# Altium project CNC_controller.PrjPcb
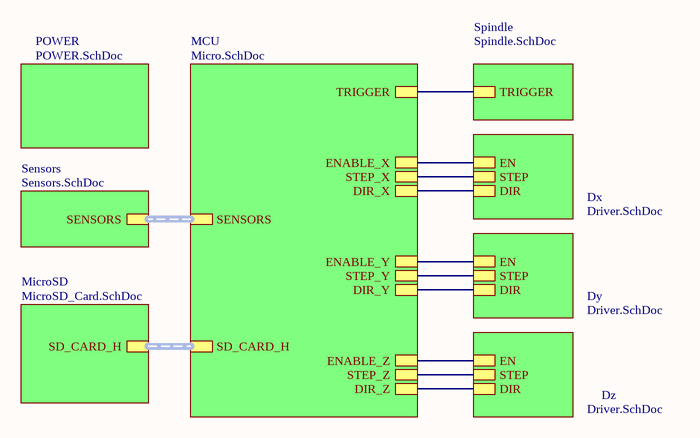
[diagram p0: Main.SchDoc]
7 sheets, 117 parts. Net scope: hierarchical (ports join the sheet entries above them; power ports are global).
Board file: CNC_controller.PcbDoc
Sheets:
  Main.SchDoc
    Spindle = Spindle.SchDoc
    POWER = POWER.SchDoc
    Dx = Driver.SchDoc
    Dy = Driver.SchDoc
    Dz = Driver.SchDoc
    MicroSD = MicroSD_Card.SchDoc
    MCU = Micro.SchDoc
    Sensors = Sensors.SchDoc

## Sheet Main.SchDoc
size A4; Organization: Altium Limited; Address1: L3, 12a Rodborough Rd; Address2: Frenchs Forest; Address3: NSW; Address4: Australia 2086; SheetNumber: 1; SheetTotal: 7

### Sub-sheets
Dx = Driver.SchDoc: EN, STEP, DIR
Dy = Driver.SchDoc: EN, STEP, DIR
Dz = Driver.SchDoc: EN, STEP, DIR
MCU = Micro.SchDoc: SD_CARD_H (harness SD_CARD_T), SENSORS (harness SENSOR), TRIGGER, ENABLE_X, STEP_X, DIR_X, ENABLE_Y, STEP_Y, DIR_Y, ENABLE_Z, STEP_Z, DIR_Z
MicroSD = MicroSD_Card.SchDoc: SD_CARD_H (harness SD_CARD_T)
POWER = POWER.SchDoc: no entries
Sensors = Sensors.SchDoc: SENSORS (harness SENSOR)
Spindle = Spindle.SchDoc: TRIGGER

### Nets
DIR: sheet Dx/DIR, sheet MCU/DIR_X
DIR: sheet Dy/DIR, sheet MCU/DIR_Y  [a separate net that carries the same name]
DIR: sheet Dz/DIR, sheet MCU/DIR_Z  [a separate net that carries the same name]
STEP: sheet Dx/STEP, sheet MCU/STEP_X
STEP: sheet Dy/STEP, sheet MCU/STEP_Y  [a separate net that carries the same name]
STEP: sheet Dz/STEP, sheet MCU/STEP_Z  [a separate net that carries the same name]
TRIGGER: sheet Spindle/TRIGGER, sheet MCU/TRIGGER
NetMD1_10: sheet Dz/EN, sheet MCU/ENABLE_Z
NetMD1_16: sheet Dy/EN, sheet MCU/ENABLE_Y
NetMD1_26: sheet Dx/EN, sheet MCU/ENABLE_X

### Buses and harness runs
harness sheet MCU/SD_CARD_H = sheet MicroSD/SD_CARD_H
harness sheet MCU/SENSORS = sheet Sensors/SENSORS

### Notes on the sheet
- Title
- Size:
- Date:
- A4
- Number:
- Time:
- Revision:
- Sheet
- of
- File:

## Sheet Spindle.SchDoc
size A4; Organization: Altium Limited; Address1: L3, 12a Rodborough Rd; Address2: Frenchs Forest; Address3: NSW; Address4: Australia 2086; SheetNumber: 3; SheetTotal: 7
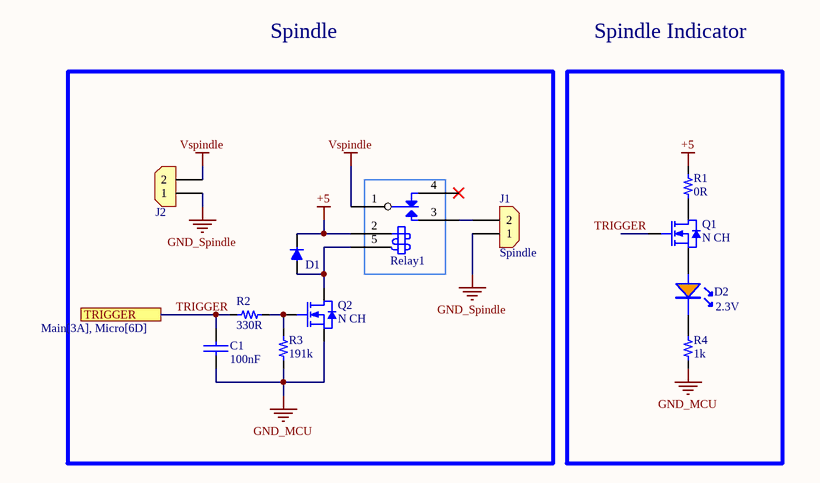
[diagram p1: Spindle.SchDoc]

### Parts
C1  value 100nF  [0603_cap]  (hidden comment: CAP CER 100nF 50V X7R 0603)
D1  DIODE STANDARD 50V 1A SOD-123F  [SOD-123FL_MCC]  (value not drawn)
D2  2.3V  [0805_LED]
J1  Connector 2pos  [CON_2x1_TH_5MM]  (value not drawn)
J2  Connector 2pos  [CON_2x1_TH_5MM]  (value not drawn)
Q1  N CH  [SOT_23_3]
Q2  N CH  [SOT_23_3]
R1  value 0R  [0603_res]  (hidden comment: 0R 1/10W)
R2  value 330R  [0603_res]  (hidden comment: 330R 1/10W)
R3  value 191k  [0603_res]  (hidden comment: 191k 1/10W)
R4  value 1k  [0603_res]  (hidden comment: 1k 1/10W)
Relay1  V_15A  [Relay_5V_15A]  (value not drawn)

### Blocks framed on the sheet
Spindle: C1 D1 J1 J2 Q2 R2 R3 Relay1

### Ports
TRIGGER (see Main[3A], Micro[6D])

### Nets
+5: D1.2(CATHODE) R1.2 Relay1.2
GND_MCU: C1.2 Q2.2(S) R3.2 R4.1  [project net GND]
GND_Spindle: J1.1 J2.1
Vspindle: J2.2 Relay1.1
TRIGGER: C1.1 Q1.1(G) R2.1 ; port TRIGGER
NetD1_1: D1.1(ANODE) Q2.3(D) Relay1.5
NetD2_1: D2.1(A) Q1.2(S)
NetD2_2: D2.2 R4.2
NetJ1_2: J1.2 Relay1.3
NetQ1_3: Q1.3(D) R1.1
NetQ2_1: Q2.1(G) R2.2 R3.1

Not connected (* = marked no-connect by the designer): Relay1 4*

### Notes on the sheet
- Spindle
- Spindle Indicator
- Title
- Size:
- Date:
- A4
- Number:
- Time:
- Revision:
- Sheet
- of
- File:

### Library data of the parts
C1 = Cap_100nF_0603_50V: 50V 100nF X7R ±10% 0603 Ceramic Capacitors RoHS; Manufacturer: FOJAN; Manufacturer Part Number: FCC0603B104K500CT; Supplier 1: LCSC; Supplier Part Number 1: C5137636; ComponentLink1Description: LCSC; ComponentLink1URL: https://www.lcsc.com/product-detail/C5137636.html
D1 = Diode 1N4001W: 25A Independent 50V 1.1V@1A 1A SOD-123F Single Diodes RoHS; Manufacturer: YONGYUTAI; Manufacturer Part Number: 1N4001W; Supplier 1: LCSC; Supplier Part Number 1: C2944152; ComponentLink1Description: LCSC; ComponentLink1URL: https://www.lcsc.com/product-detail/C2944152.html
D2 = LED_0805_Orange: LED ORANGE WATER CLEAR 0805 SMD; Manufacturer: XINGLIGHT; Manufacturer Part Number: XL-2012UOC; Supplier 1: LCSC; Supplier Part Number 1: C965813; ComponentLink1Description: LCSC; ComponentLink1URL: https://www.lcsc.com/product-detail/C965813.html?s_z=n_XINGLIGHT%2520XL-2012
J1 J2 = Con_2x1_TH_5mm: 2POS 5MM; Manufacturer: JILN; Manufacturer Part Number: JL126-50002G01; Supplier 1: LCSC; Supplier Part Number 1: C394556; ComponentLink1Description: Digi-Key; ComponentLink1URL: https://www.lcsc.com/product-detail/Screw-terminal_JILN-JL126-50002G01_C394556.html
Q1 = Q_NFET_50V_200mA_SOT23: MOSFET N-CH 50V 200mA SOT-23; Manufacturer: onsemi; Manufacturer Part Number: BSS138LT1G; Supplier 1: LCSC; Supplier Part Number 1: C82045; ComponentLink1Description: LCSC; ComponentLink1URL: https://www.lcsc.com/product-detail/C82045.html
Q2 = Q_NFET_20V_3.2A_SOT23: MOSFET N-CH 20V SOT23; Manufacturer: Doeshare; Manufacturer Part Number: DN2302S; Supplier 1: LCSC; Supplier Part Number 1: C2931750; ComponentLink1Description: LCSC; ComponentLink1URL: https://www.lcsc.com/product-detail/MOSFETs_Doeshare-DN2302S_C2931750.html
R1 = Res_0R_0603_1/10W: RES SMD 0R OHM 5% 1/10W 0603; Manufacturer: FOJAN; Manufacturer Part Number: FRC0603P000 TS; ComponentLink1URL: https://www.lcsc.com/product-detail/Chip-Resistor-Surface-Mount_FOJAN-FRC0603P000-TS_C2907080.html; Supplier 1: LCSC; Supplier Part Number 1: C2907080; ComponentLink1Description: LCSC
R2 = Res_330R_0603_1/10W: RES SMD 330R OHM 5% 1/10W 0603; Manufacturer: FOJAN; Manufacturer Part Number: FRC0603J331 TS; ComponentLink1URL: https://www.lcsc.com/product-detail/Chip-Resistor-Surface-Mount_FOJAN-FRC0603J331-TS_C2907152.html; Supplier 1: LCSC; Supplier Part Number 1: C2907152; ComponentLink1Description: LCSC
R3 = Res_191k_0603_1/10W: 100mW Thick Film Resistor 75V ±100ppm/℃ ±1% 191kΩ 0603 Chip Resistor - Surface Mount ROHS; Manufacturer: YAGEO; Manufacturer Part Number: AC0603FR-07191KL; ComponentLink1URL: https://lcsc.com/product-detail/Chip-Resistor-Surface-Mount_YAGEO-AC0603FR-07191KL_C227635.html; Supplier 1: LCSC; Supplier Part Number 1: C227635; ComponentLink1Description: LCSC
R4 = Res_1k_0603_1/10W: RES SMD 1k OHM 5% 1/10W 0603; Manufacturer: FOJAN; Manufacturer Part Number: FRC0603J102 TS; ComponentLink1URL: https://www.lcsc.com/product-detail/Chip-Resistor-Surface-Mount_FOJAN-FRC0603J102-TS_C2907113.html; Supplier 1: LCSC; Supplier Part Number 1: C2907113; ComponentLink1Description: LCSC
Relay1 = Relay_5V_15A: 250V@AC 5V 15A 1 Form C: 1C (SPDT-CO) Plugin,15.6x19.2mm Power Relays ROHS; Manufacturer: Ningbo Songle Relay; Manufacturer Part Number: SRD-05VDC-SL-C; Supplier 1: LCSC; Supplier Part Number 1: C35449; ComponentLink1Description: LCSC; ComponentLink1URL: https://lcsc.com/product-detail/Power-Relays_Ningbo-Songle-Relay-SRD-05VDC-SL-C_C35449.html

## Sheet POWER.SchDoc
size A4; Organization: Altium Limited; Address1: L3, 12a Rodborough Rd; Address2: Frenchs Forest; Address3: NSW; Address4: Australia 2086; SheetNumber: 4; SheetTotal: 7
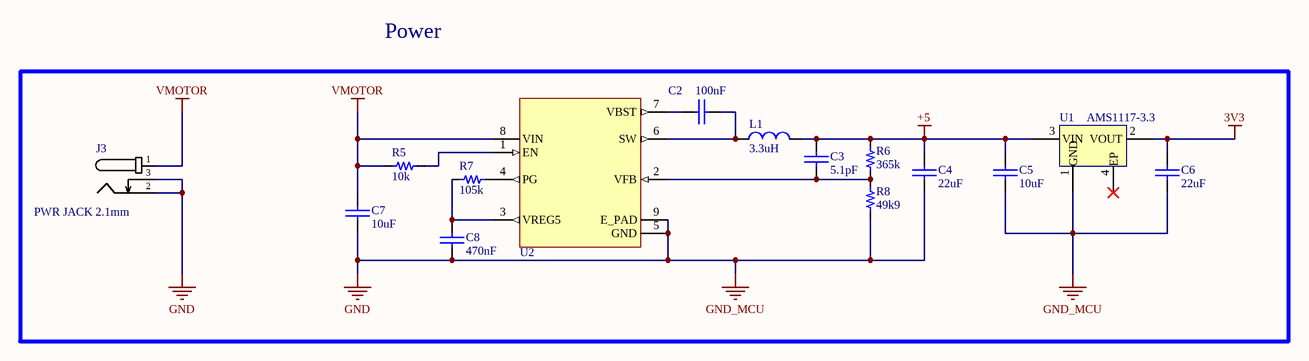
[diagram p2: POWER.SchDoc]

### Parts
C2  value 100nF  [0603_cap]  (hidden comment: CAP CER 100nF 50V X7R 0603)
C3  value 5.1pF  [0603_cap]  (hidden comment: Cap_5.1pF)
C4  value 22uF  [0603_cap]  (hidden comment: 22uF 10V)
C5  value 10uF  [0603_cap]  (hidden comment: 10uF 10V)
C6  value 22uF  [0603_cap]  (hidden comment: 22uF 10V)
C7  value 10uF  [0805_cap]  (hidden comment: 10uF 25V)
C8  value 470nF  [0603_cap]  (hidden comment: 470nF 50V)
J3  PWR JACK 2.1mm  [CON_POWER_BARREL_2.1MM_3CONN]
L1  value 3.3uH  [Inductor_3_3uH]  (hidden comment: FIXED IND 3.3uH 2.6A 0.052Ω SMD,4x4mm)
R5  value 10k  [0603_res]  (hidden comment: 10k 1/10W)
R6  value 365k  [0603_res]  (hidden comment: 365k 1/10W)
R7  value 105k  [0603_res]  (hidden comment: Res 105k)
R8  value 49k9  [0603_res]  (hidden comment: 49k9 1/10W)
U1  AMS1117-3.3  [SOT_223]
U2  TPS56528DDAR  [SOIC_8_3.9mm_EP]  (value not drawn)

### Nets
3V3: C6.1 U1.2(VOUT)
+5: C3.1 C4.1 C5.1 L1.2 R6.2 U1.3(VIN)
GND: C4.2 C5.2 C6.2 C7.2 C8.2 J3.2 J3.3 R8.1 U1.1(GND) U2.5(GND) U2.9(E_PAD)  [also labelled GND_MCU]
VMOTOR: C7.1 J3.1 R5.1 U2.8(VIN)
NetC2_1: C2.1 L1.1 U2.6(SW)
NetC2_2: C2.2 U2.7(VBST)
NetC3_2: C3.2 R6.1 R8.2 U2.2(VFB)
NetC8_1: C8.1 R7.1 U2.3(VREG5)
NetR5_2: R5.2 U2.1(EN)
NetR7_2: R7.2 U2.4(PG)

Not connected (* = marked no-connect by the designer): U1 4(EP)*

### Notes on the sheet
- Power
- Title
- Size:
- Date:
- A4
- Number:
- Time:
- Revision:
- Sheet
- of
- File:

### Library data of the parts
C2 = Cap_100nF_0603_50V: as C1 on sheet Spindle; Supplier 1: LCSC; Supplier Part Number 1: C5137636; ComponentLink1Description: LCSC; ComponentLink1URL: https://www.lcsc.com/product-detail/C5137636.html
C3 = Cap_5.1pF: 50V 5.1pF NP0 0603 Ceramic Capacitors RoHS; Manufacturer: YAGEO; Manufacturer Part Number: CC0603CRNPO9BN5R1; Supplier 1: LCSC; Supplier Part Number 1: C519376; ComponentLink1Description: LCSC; ComponentLink1URL: https://www.lcsc.com/product-detail/C519376.html?s_z=n_5.1pF%2520capacitor
C4 C6 = Cap_22uF_0603_10V: 10V 22uF X5R ±20% 0603 Multilayer Ceramic Capacitors MLCC - SMD/SMT ROHS; Manufacturer: HRE; Manufacturer Part Number: CGA0603X5R226M100JT; Supplier 1: LCSC; Supplier Part Number 1: C6119863; ComponentLink1Description: LCSC; ComponentLink1URL: https://lcsc.com/product-detail/Multilayer-Ceramic-Capacitors-MLCC-SMD-SMT_HRE-CGA0603X5R226M100JT_C6119863.html
C5 = Cap_10uF_0603_10V: 10V 10uF X5R ±10% 0603 Multilayer Ceramic Capacitors MLCC - SMD/SMT ROHS; Manufacturer: CCTC; Manufacturer Part Number: TCC0603X5R106K100CT; Supplier 1: LCSC; Supplier Part Number 1: C380314; ComponentLink1Description: LCSC; ComponentLink1URL: https://www.lcsc.com/product-detail/Multilayer-Ceramic-Capacitors-MLCC-SMD-SMT_CCTC-TCC0603X5R106K100CT_C380314.html
C7 = Cap_10uF_0805_25V_: 25V 10uF X5R ±10% 0805 Multilayer Ceramic Capacitors MLCC - SMD/SMT ROHS; Manufacturer: Samsung Electro-Mechanics; Manufacturer Part Number: CL21A106KAYNNNE; Supplier 1: LCSC; Supplier Part Number 1: C15850; ComponentLink1Description: LCSC; ComponentLink1URL: https://lcsc.com/product-detail/Multilayer-Ceramic-Capacitors-MLCC-SMD-SMT_Samsung-Electro-Mechanics-CL21A106KAYNNNE_C15850.html
C8 = Cap_470nF_0603_50V: 50V 470nF X7R ±10% 0603 Multilayer Ceramic Capacitors MLCC - SMD/SMT ROHS; Manufacturer: Chinocera; Manufacturer Part Number: HGC0603R7474K500NTHJ; Supplier 1: LCSC; Supplier Part Number 1: C33546006; ComponentLink1Description: LCSC; ComponentLink1URL: https://lcsc.com/product-detail/Multilayer-Ceramic-Capacitors-MLCC-SMD-SMT_Chinocera-HGC0603R7474K500NTHJ_C33546006.html
J3 = Con_Power_Jack_2.1mm_3pins: CONN PWR JACK 2X5.5MM SOLDER; Manufacturer: HCTL; Manufacturer Part Number: HC-DC-005-2.0T; Supplier 1: LCSC; Supplier Part Number 1: C3010533; ComponentLink1Description: LCSC; ComponentLink1URL: https://www.lcsc.com/product-detail/AC-DC-Power-Connectors_HCTL-HC-DC-005-2-0T_C3010533.html
L1 = Inductor_3.3uH: 2.6A 3.3uH Magnetic Shielded Inductor ±20% 3.6A 52mΩ SMD,4x4mm Fixed Inductors RoHS; Manufacturer: cjiang; Manufacturer Part Number: FNR4030S3R3MT; Supplier 1: LCSC; Supplier Part Number 1: C167870; ComponentLink1Description: LCSC; ComponentLink1URL: https://www.lcsc.com/product-detail/C167870.html?s_z=n_3.3uH%2520inductor
R5 = Res_10k_0603_1/10W: RES SMD 10k OHM 5% 1/10W 0603; Manufacturer: FOJAN; Manufacturer Part Number: FRC0603J103TS; ComponentLink1URL: https://www.lcsc.com/product-detail/Chip-Resistor-Surface-Mount_FOJAN-FRC0603J103TS_C2930027.html; Supplier 1: LCSC; Supplier Part Number 1: C2930027; ComponentLink1Description: LCSC
R6 = Res_365k_0603_1/10W: 100mW Thick Film Resistor 75V ±100ppm/℃ ±1% 365kΩ 0603 Chip Resistor - Surface Mount ROHS; Manufacturer: YAGEO; Manufacturer Part Number: RC0603FR-07365KL; ComponentLink1URL: https://lcsc.com/product-detail/Chip-Resistor-Surface-Mount_YAGEO-RC0603FR-07365KL_C185336.html; Supplier 1: LCSC; Supplier Part Number 1: C185336; ComponentLink1Description: LCSC
R7 = Res 105k: 100mW 105kΩ 75V ±25ppm/℃ Thin Film Resistor ±0.5% 0603 Chip Resistor - Surface Mount RoHS; Manufacturer: YAGEO; Manufacturer Part Number: RT0603DRD07105KL; ComponentLink1URL: https://www.lcsc.com/product-detail/C862523.html; Supplier 1: LCSC; Supplier Part Number 1: C862523; ComponentLink1Description: LCSC
R8 = Res_49k9_0603_1/10W: 100mW Thick Film Resistor 75V ±100ppm/℃ ±1% 49.9kΩ 0603 Chip Resistor - Surface Mount ROHS; Manufacturer: YAGEO; Manufacturer Part Number: RC0603FR-0749K9L; ComponentLink1URL: https://lcsc.com/product-detail/Chip-Resistor-Surface-Mount_YAGEO-RC0603FR-0749K9L_C114624.html; Supplier 1: LCSC; Supplier Part Number 1: C114624; ComponentLink1Description: LCSC
U1 = LDO_3V3_1A_FIXED: 1A 60dB@(120Hz) Fixed 3.3V Positive 18V SOT-223 Linear Voltage Regulators (LDO) ROHS; Manufacturer: UMW(Youtai Semiconductor Co., Ltd.); ComponentLink1Description: LCSC; ComponentLink1URL: https://www.lcsc.com/product-detail/_UMW-Youtai-Semiconductor-Co-Ltd-_C347222.html; Supplier 1: LCSC; Manufacturer Part Number: AMS1117-3.3; Supplier Part Number 1: C347222
U2 = DCDC_SW_BUCK_5A_SOIC8: IC REG BUCK ADJ 5A 8SOPWR; Manufacturer: Texas Instruments; Manufacturer Part Number: TPS56528DDAR; Supplier 1: LCSC; Supplier Part Number 1: C138716; ComponentLink1Description: LCSC; ComponentLink1URL: https://lcsc.com/product-detail/DC-DC-Converters_Texas-Instruments-TPS56528DDAR_C138716.html

## Sheet Driver.SchDoc
size A4; Organization: Altium Limited; Address1: L3, 12a Rodborough Rd; Address2: Frenchs Forest; Address3: NSW; Address4: Australia 2086; SheetNumber: 5; SheetTotal: 7
Used 3 times, as channels Dx, Dy, Dz. Parts and nets are listed once, with the designators drawn on the sheet.
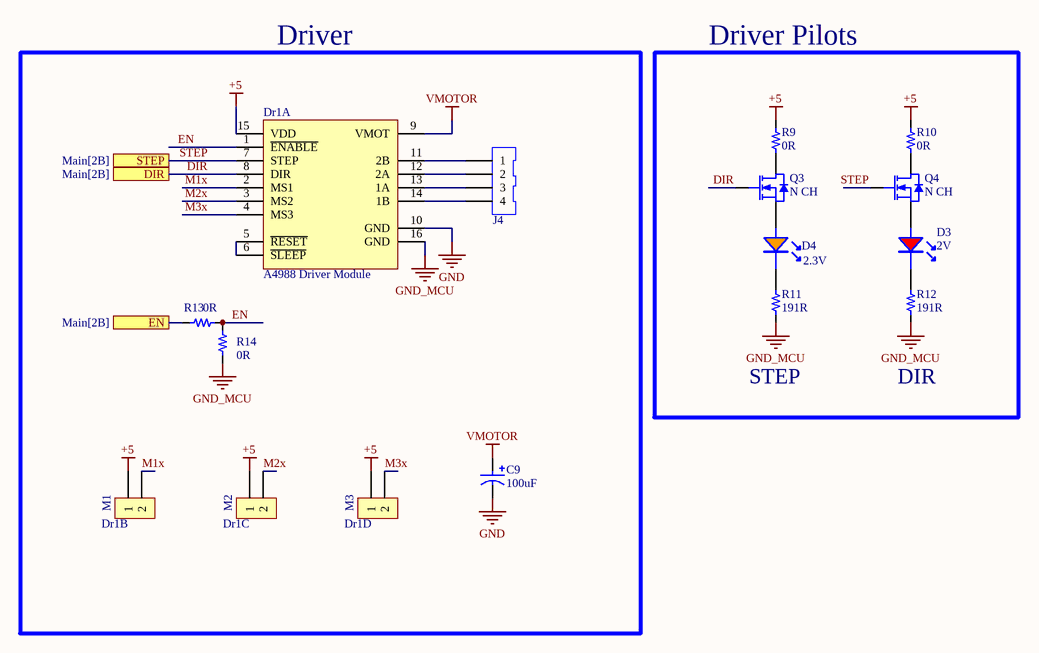
[diagram p3: Driver.SchDoc]

### Parts
C9  value 100uF  [CAP_TH]  (hidden comment: Cap_100uF_Electr_TH_50V)
D3  2V  [0805_LED]
D4  2.3V  [0805_LED]
Dr1  A4988 Driver Module  [A4988 Module]  (parts A,B,C,D of 4)
J4  CONN HEADER TH 4POS 2.5mm  [JST_B4B-XH-A]  (value not drawn)
Q3  N CH  [SOT_23_3]
Q4  N CH  [SOT_23_3]
R9  value 0R  [0603_res]  (hidden comment: 0R 1/10W)
R10  value 0R  [0603_res]  (hidden comment: 0R 1/10W)
R11  value 191R  [0603_res]  (hidden comment: 191R 1/10W)
R12  value 191R  [0603_res]  (hidden comment: 191R 1/10W)
R13  value 0R  [0603_res]  (hidden comment: 0R 1/10W)
R14  value 0R  [0603_res]  (hidden comment: 0R 1/10W)

### Blocks framed on the sheet
Driver: C9 Dr1 J4 R13 R14
Driver Pilots: D3 D4 Q3 Q4 R9-R12

### Ports
DIR (see Main[2B]), EN (see Main[2B]), STEP (see Main[2B])

### Nets
+5: Dr1.15(VDD) Dr1.17(1) Dr1.19(1) Dr1.21(1) R9.2 R10.2
GND: C9.2 Dr1.10(GND)
GND_MCU: Dr1.16(GND) R11.1 R12.1 R14.1
VMOTOR: C9.1 Dr1.9(VMOT)
DIR: Dr1.8(DIR) Q3.1(G) ; port DIR
EN: Dr1.1(~{ENABLE}) R13.2 R14.2
EN: R13.1 ; port EN  [a separate net that carries the same name]
M1x: Dr1.2(MS1) Dr1.18(2)
M2x: Dr1.3(MS2) Dr1.20(2)
M3x: Dr1.4(MS3) Dr1.22(2)
STEP: Dr1.7(STEP) Q4.1(G) ; port STEP
NetD3_1: D3.1(A) Q4.2(S)
NetD3_2: D3.2 R12.2
NetD4_1: D4.1(A) Q3.2(S)
NetD4_2: D4.2 R11.2
NetDr1_5: Dr1.5(~{RESET}) Dr1.6(~{SLEEP})
NetDr1_11: Dr1.11(2B) J4.1
NetDr1_12: Dr1.12(2A) J4.2
NetDr1_13: Dr1.13(1A) J4.3
NetDr1_14: Dr1.14(1B) J4.4
NetQ3_3: Q3.3(D) R9.1
NetQ4_3: Q4.3(D) R10.1

### Channels
Dx: designators end in _Dx; ports DIR=DIR EN=NetMD1_26 STEP=STEP
Dy: designators end in _Dy; ports DIR=DIR EN=NetMD1_16 STEP=STEP
Dz: designators end in _Dz; ports DIR=DIR EN=NetMD1_10 STEP=STEP

### Notes on the sheet
- STEP
- DIR
- Title
- Size:
- Date:
- A4
- Number:
- Time:
- Revision:
- Sheet
- of
- File:
- (in symbol A4988 Driver Module, part B) M1
- (in symbol A4988 Driver Module, part C) M2
- (in symbol A4988 Driver Module, part D) M3

### Library data of the parts
D3 = LED_0805_RED: LED RED CLEAR 0805 SMD; Manufacturer: XINGLIGHT; Manufacturer Part Number: XL-2012SURC; Supplier 1: LCSC; Supplier Part Number 1: C965812; ComponentLink1Description: LCSC; ComponentLink1URL: https://www.lcsc.com/product-detail/Light-Emitting-Diodes-LED_XINGLIGHT-XL-2012SURC_C965812.html
D4 = LED_0805_Orange: as D2 on sheet Spindle; Supplier 1: LCSC; Supplier Part Number 1: C965813; ComponentLink1Description: LCSC; ComponentLink1URL: https://www.lcsc.com/product-detail/C965813.html?s_z=n_XINGLIGHT%2520XL-2012
J4 = Connector JST 4pin: 4P XH 1x4P Tin -25℃~+85℃ White 2.5mm 250V 4 3A 1 Through Hole Through Hole,P=2.5mm Headers, Male Pins RoHS; Manufacturer: JST; Manufacturer Part Number: B4B-XH-A(LF)(SN); Supplier 1: LCSC; Supplier Part Number 1: C144395; ComponentLink1Description: LCSC; ComponentLink1URL: https://www.lcsc.com/product-detail/C144395.html?s_z=n_JST%2520b4b
Q3 Q4 = Q_NFET_50V_200mA_SOT23: as Q1 on sheet Spindle; Supplier 1: LCSC; Supplier Part Number 1: C82045; ComponentLink1Description: LCSC; ComponentLink1URL: https://www.lcsc.com/product-detail/C82045.html
R9 R10 R13 R14 = Res_0R_0603_1/10W: as R1 on sheet Spindle; ComponentLink1URL: https://www.lcsc.com/product-detail/Chip-Resistor-Surface-Mount_FOJAN-FRC0603P000-TS_C2907080.html; Supplier 1: LCSC; Supplier Part Number 1: C2907080; ComponentLink1Description: LCSC
R11 R12 = Res_191R_0603_1/10W: 100mW Thick Film Resistor 75V ±100ppm/℃ ±1% 191Ω 0603 Chip Resistor - Surface Mount ROHS; Manufacturer: FOJAN; Manufacturer Part Number: FRC0603F1910TS; ComponentLink1URL: https://lcsc.com/product-detail/Chip-Resistor-Surface-Mount_FOJAN-FRC0603F1910TS_C3000718.html; Supplier 1: LCSC; Supplier Part Number 1: C3000718; ComponentLink1Description: LCSC
C9 = Cap_100uF_Electr_TH_50V: Supplier 1: LCSC; ComponentLink1Description: LCSC

## Sheet MicroSD_Card.SchDoc
size A4; Organization: Altium Limited; Address1: L3, 12a Rodborough Rd; Address2: Frenchs Forest; Address3: NSW; Address4: Australia 2086; SheetNumber: 6; SheetTotal: 7
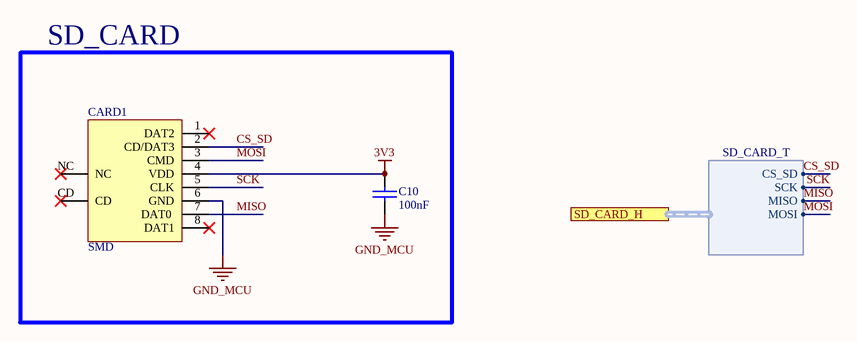
[diagram p4: MicroSD_Card.SchDoc]

### Parts
C10  value 100nF  [0603_cap]  (hidden comment: CAP CER 100nF 50V X7R 0603)
CARD1  SMD  [SD_CARD_PUSH_PCB]

### Blocks framed on the sheet
SD_CARD: C10 CARD1

### Ports
SD_CARD_H (harness SD_CARD_T, see Main[2C], Micro[3C])

### Harnesses
SD_CARD_T: SCK, MISO, MOSI, CS_SD

### Nets
3V3: C10.1 CARD1.4(VDD)
GND_MCU: C10.2 CARD1.6(GND)  [project net GND]
CS_SD: CARD1.2(CD/DAT3) ; port SD_CARD_H.CS_SD
MISO: CARD1.7(DAT0) ; port SD_CARD_H.MISO
MOSI: CARD1.3(CMD) ; port SD_CARD_H.MOSI
SCK: CARD1.5(CLK) ; port SD_CARD_H.SCK

Not connected (* = marked no-connect by the designer): CARD1 1(DAT2)* 8(DAT1)* CD* NC*

### Notes on the sheet
- Title
- Size:
- Date:
- A4
- Number:
- Time:
- Revision:
- Sheet
- of
- File:

### Library data of the parts
C10 = Cap_100nF_0603_50V: as C1 on sheet Spindle; Supplier 1: LCSC; Supplier Part Number 1: C5137636; ComponentLink1Description: LCSC; ComponentLink1URL: https://www.lcsc.com/product-detail/C5137636.html
CARD1 = SD_CARD_PUSH: Push-Push 2mm Connector and Ejector MicroSD Card (TF Card) SMD PC Card Sockets RoHS; Manufacturer: Yuandi; Manufacturer Part Number: TF-01A; Supplier 1: LCSC; Supplier Part Number 1: C2889258; ComponentLink1Description: LCSC; ComponentLink1URL: https://www.lcsc.com/product-detail/C2889258.html?s_z=n_TF-01A_C2889258

## Sheet Micro.SchDoc
size 431 x 279 mm; Organization: Altium Limited; Address1: L3, 12a Rodborough Rd; Address2: Frenchs Forest; Address3: NSW; Address4: Australia 2086; SheetNumber: 7; SheetTotal: 7
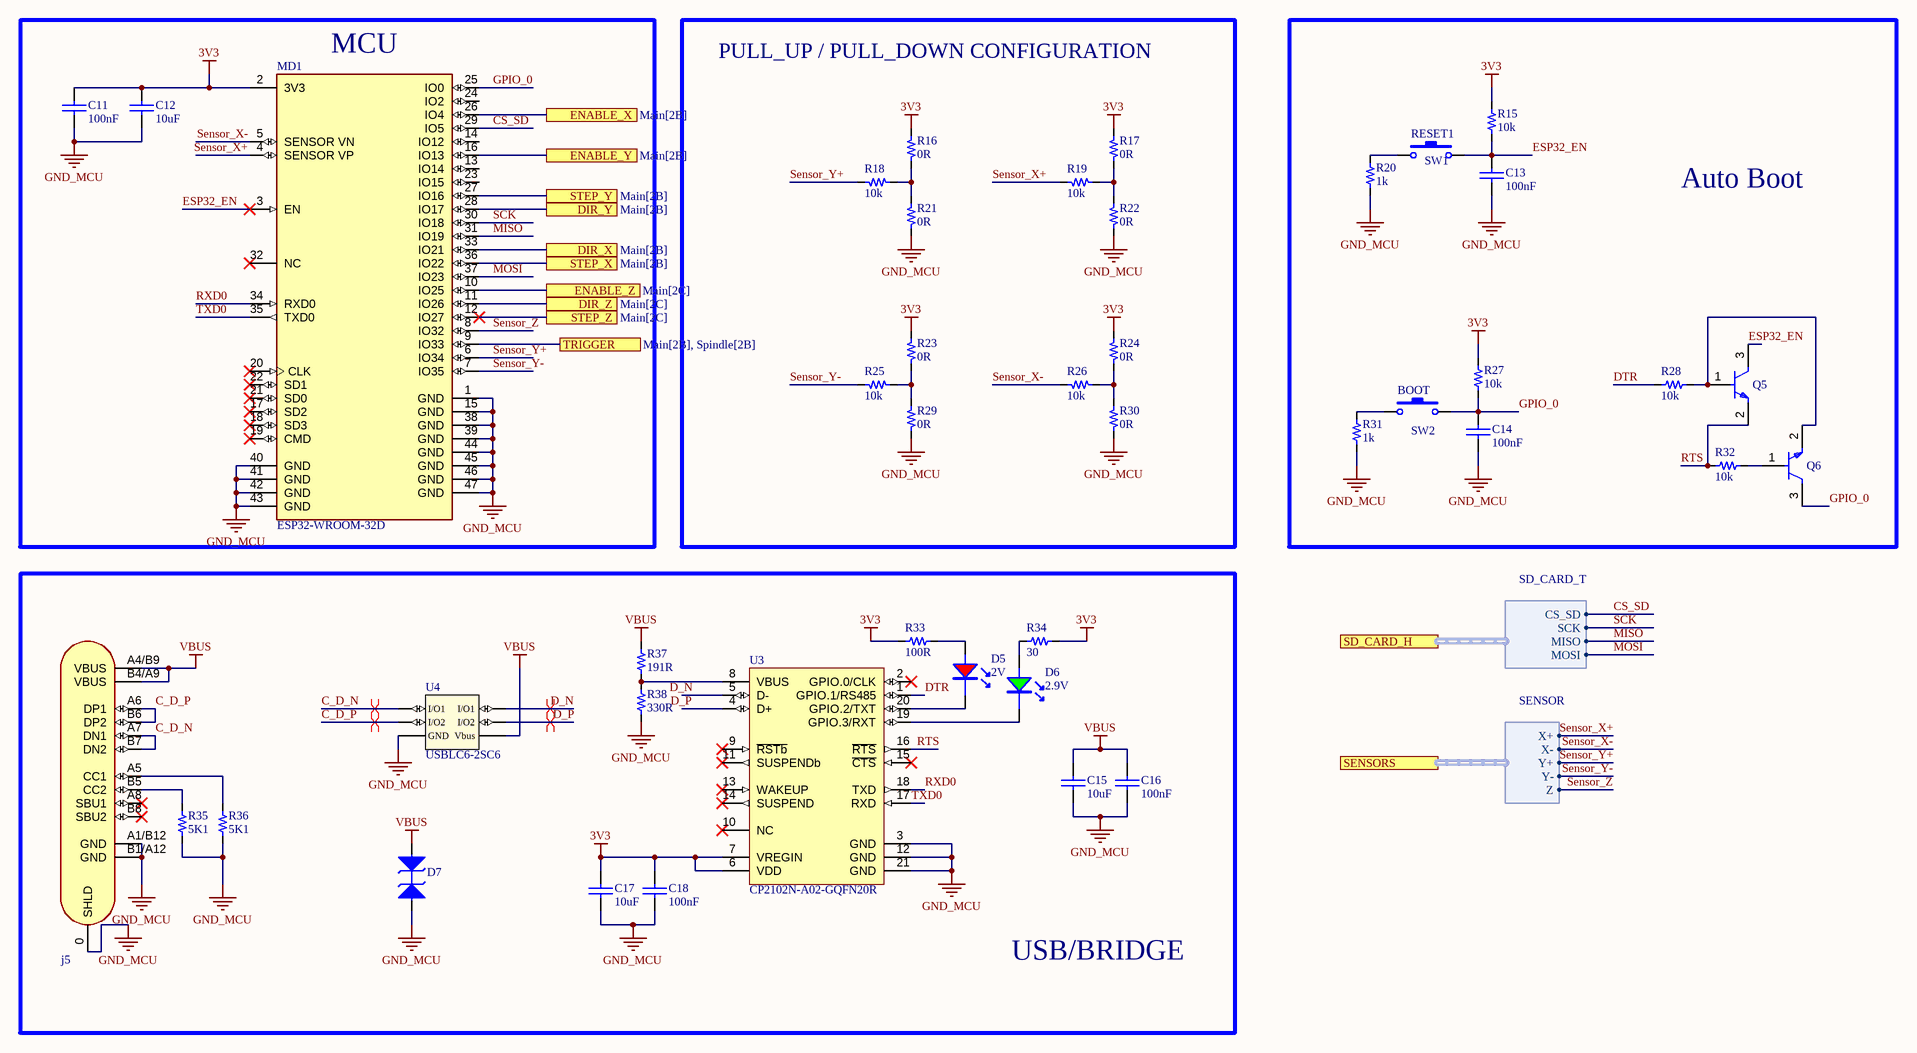
[diagram p5: Micro.SchDoc]

### Parts
C11  value 100nF  [0603_cap]  (hidden comment: CAP CER 100nF 50V X7R 0603)
C12  value 10uF  [0603_cap]  (hidden comment: 10uF 10V)
C13  value 100nF  [0603_cap]  (hidden comment: CAP CER 100nF 50V X7R 0603)
C14  value 100nF  [0603_cap]  (hidden comment: CAP CER 100nF 50V X7R 0603)
C15  value 10uF  [0603_cap]  (hidden comment: 10uF 10V)
C16  value 100nF  [0603_cap]  (hidden comment: CAP CER 100nF 50V X7R 0603)
C17  value 10uF  [0603_cap]  (hidden comment: 10uF 10V)
C18  value 100nF  [0603_cap]  (hidden comment: CAP CER 100nF 50V X7R 0603)
D5  2V  [0805_LED]
D6  2.9V  [0805_LED]
D7  TVS 12V  [SOD_123FL]  (value not drawn)
j5  USB C  [CON_USB_C_16P_RA]  (value not drawn)
MD1  ESP32-WROOM-32D  [MOD_ESP32-WROOM-32_EXP]
Q5  TRANS NPN 40V 200mA SOT-23  [SOT_23_3]  (value not drawn)
Q6  TRANS NPN 40V 200mA SOT-23  [SOT_23_3]  (value not drawn)
R15  value 10k  [0603_res]  (hidden comment: 10k 1/10W)
R16  value 0R  [0603_res]  (hidden comment: 0R 1/10W)
R17  value 0R  [0603_res]  (hidden comment: 0R 1/10W)
R18  value 10k  [0603_res]  (hidden comment: 10k 1/10W)
R19  value 10k  [0603_res]  (hidden comment: 10k 1/10W)
R20  value 1k  [0603_res]  (hidden comment: 1k 1/10W)
R21  value 0R  [0603_res]  (hidden comment: 0R 1/10W)
R22  value 0R  [0603_res]  (hidden comment: 0R 1/10W)
R23  value 0R  [0603_res]  (hidden comment: 0R 1/10W)
R24  value 0R  [0603_res]  (hidden comment: 0R 1/10W)
R25  value 10k  [0603_res]  (hidden comment: 10k 1/10W)
R26  value 10k  [0603_res]  (hidden comment: 10k 1/10W)
R27  value 10k  [0603_res]  (hidden comment: 10k 1/10W)
R28  value 10k  [0603_res]  (hidden comment: 10k 1/10W)
R29  value 0R  [0603_res]  (hidden comment: 0R 1/10W)
R30  value 0R  [0603_res]  (hidden comment: 0R 1/10W)
R31  value 1k  [0603_res]  (hidden comment: 1k 1/10W)
R32  value 10k  [0603_res]  (hidden comment: 10k 1/10W)
R33  value 100R  [0603_res]  (hidden comment: 100R 1/10W)
R34  value 30  [0603_res]  (hidden comment: RES 30Ω ±5% 100mW 0603)
R35  value 5K1  [0603_res]  (hidden comment: RES 5.1kΩ ±1% 100mW 0603)
R36  value 5K1  [0603_res]  (hidden comment: RES 5.1kΩ ±1% 100mW 0603)
R37  value 191R  [0603_res]  (hidden comment: 191R 1/10W)
R38  value 330R  [0603_res]  (hidden comment: 330R 1/10W)
SW1  Sw  [Sw_PUSH_4.5x4.5x5mm]  (value not drawn)
SW2  Sw  [Sw_PUSH_4.5x4.5x5mm]  (value not drawn)
U3  CP2102N-A02-GQFN20R  [WFQFN_20_EP_3X3MM]
U4  USBLC6-2SC6  [SOT_23_6]

### Blocks framed on the sheet
MCU: C11 C12 MD1
PULL_UP / PULL_DOWN CONFIGURATION: R16-R19 R21-R26 R29 R30
Auto Boot: C13 C14 Q5 Q6 R15 R20 R27 R28 R31 R32 SW1 SW2
USB/BRIDGE: C15-C18 D5-D7 j5 R33-R38 U3 U4

### Ports
DIR_X (see Main[2B]), DIR_Y (see Main[2B]), DIR_Z (see Main[2C]), ENABLE_X (see Main[2B]), ENABLE_Y (see Main[2B]), ENABLE_Z (see Main[2C]), SD_CARD_H (harness SD_CARD_T, see Main[2C], MicroSD_Card[3B]), SENSORS (harness SENSOR, see Main[2B], Sensors[4C]), STEP_X (see Main[2B]), STEP_Y (see Main[2B]), STEP_Z (see Main[2C]), TRIGGER (see Main[2B], Spindle[2B])

### Harnesses
SD_CARD_T: SCK, MISO, MOSI, CS_SD
SENSOR: X-, Y+, Y-, X+, Z

### Nets
3V3: C11.1 C12.1 C17.1 C18.1 MD1.2(3V3) R15.2 R16.1 R17.1 R23.1 R24.1 R27.2 R33.1 R34.2 U3.6(VDD) U3.7(VREGIN)
GND_MCU: C11.2 C12.2 C13.2 C14.2 C15.2 C16.2 C17.2 C18.2 D7.2 j5.0(SHLD) j5.A1/B12(GND) j5.B1/A12(GND) MD1.1(GND) MD1.15(GND) MD1.38(GND) MD1.39(GND) MD1.40(GND) MD1.41(GND) MD1.42(GND) MD1.43(GND) MD1.44(GND) MD1.45(GND) MD1.46(GND) MD1.47(GND) R20.1 R21.1 R22.1 R29.1 R30.1 R31.1 R35.1 R36.1 R38.1 U3.3(GND) U3.12(GND) U3.21(GND) U4.2(GND)  [project net GND]
VBUS: C15.1 C16.1 D7.1 j5.A4/B9(VBUS) j5.B4/A9(VBUS) R37.2 U4.5(Vbus)
C_D_N: j5.A7(DN1) j5.B7(DN2) U4.1(I/O1)
C_D_P: j5.A6(DP1) j5.B6(DP2) U4.3(I/O2)
CS_SD: MD1.29(IO5) ; port SD_CARD_H.CS_SD
D_N: U3.5(D-) U4.6(I/O1)
D_P: U3.4(D+) U4.4(I/O2)
DIR: MD1.33(IO21) ; port DIR_X
DIR: MD1.28(IO17) ; port DIR_Y  [a separate net that carries the same name]
DIR: MD1.11(IO26) ; port DIR_Z  [a separate net that carries the same name]
DTR: R28.2 U3.1(GPIO.1/RS485)
ESP32_EN: C13.1 MD1.3(EN) Q5.3(C) R15.1 SW1.2
GPIO_0: C14.1 MD1.25(IO0) Q6.3(C) R27.1 SW2.2
MISO: MD1.31(IO19) ; port SD_CARD_H.MISO
MOSI: MD1.37(IO23) ; port SD_CARD_H.MOSI
RTS: Q5.2(E) R32.2 U3.16(~{RTS})
RXD0: MD1.34(RXD0) U3.18(TXD)
SCK: MD1.30(IO18) ; port SD_CARD_H.SCK
Sensor_X+: MD1.4(SENSOR_VP) R19.2 ; port SENSORS.X+
Sensor_X-: MD1.5(SENSOR_VN) R26.2 ; port SENSORS.X-
Sensor_Y+: MD1.6(IO34) R18.2 ; port SENSORS.Y+
Sensor_Y-: MD1.7(IO35) R25.2 ; port SENSORS.Y-
Sensor_Z: MD1.8(IO32) ; port SENSORS.Z
STEP: MD1.36(IO22) ; port STEP_X
STEP: MD1.27(IO16) ; port STEP_Y  [a separate net that carries the same name]
STEP: MD1.12(IO27) ; port STEP_Z  [a separate net that carries the same name]
TRIGGER: MD1.9(IO33) ; port TRIGGER
TXD0: MD1.35(TXD0) U3.17(RXD)
NetD5_1: D5.1(A) R33.2
NetD5_2: D5.2 U3.20(GPIO.2/TXT)
NetD6_1: D6.1(A) R34.1
NetD6_2: D6.2 U3.19(GPIO.3/RXT)
Netj5_A5: j5.A5(CC1) R36.2
Netj5_B5: j5.B5(CC2) R35.2
NetMD1_10: MD1.10(IO25) ; port ENABLE_Z
NetMD1_16: MD1.16(IO13) ; port ENABLE_Y
NetMD1_26: MD1.26(IO4) ; port ENABLE_X
NetQ5_1: Q5.1(B) Q6.2(E) R28.1
NetQ6_1: Q6.1(B) R32.1
NetR16_2: R16.2 R18.1 R21.2
NetR17_2: R17.2 R19.1 R22.2
NetR20_2: R20.2 SW1.1
NetR23_2: R23.2 R25.1 R29.2
NetR24_2: R24.2 R26.1 R30.2
NetR31_2: R31.2 SW2.1
NetR37_1: R37.1 R38.2 U3.8(VBUS)

Not connected (* = marked no-connect by the designer): j5 A8(SBU1)* B8(SBU2)*; MD1 13(IO14) 14(IO12) 17(SD2)* 18(SD3)* 19(CMD)* 20(CLK)* 21(SD0)* 22(SD1)* 23(IO15) 24(IO2) 32(NC)*; U3 2(GPIO.0/CLK)* 9(~{RSTb})* 10(NC)* 11(SUSPENDb)* 13(WAKEUP)* 14(SUSPEND)* 15(~{CTS})*

### Layout directives
differential pair: C_D_N, C_D_P, D_N, D_P

### Notes on the sheet
- (near SW1) RESET1
- (near SW2) BOOT
- DWG. NO.
- REV.
- SHT.
- THIS DOCUMENT AND THE DATA DISCLOSED HEREIN OR HEREWITH IS THE PROPERTY OF ALTIUM LIMITED AND MAY BE FREELY DISTRIBUTED IN WHOLE. NO RIGHTS ARE RESERVED OR EXPRESS OR IMPLIED WARANTEE GIVEN.
- REVISION
- DESCRIPTION
- DATE
- APPROVED
- ENG:
- APPROVALS
- PROJECT
- DSN:
- CHK:
- REFERENCE DOCUMENTS
- PROJECT REVISION:
- TITLE
- DOCUMENT REVISION:
- DESIGN ITEM:
- BOM:
- FAB DWG:
- PCB DWG:
- ASSY DWG:
- SCALE:
- SIZE
- B
- CAGE CODE
- FILE NAME
- DWG NO.
- SHEET
- OF
- REV

### Library data of the parts
C11 C13 C14 C16 C18 = Cap_100nF_0603_50V: as C1 on sheet Spindle; Supplier 1: LCSC; Supplier Part Number 1: C5137636; ComponentLink1Description: LCSC; ComponentLink1URL: https://www.lcsc.com/product-detail/C5137636.html
C12 C15 C17 = Cap_10uF_0603_10V: as C5 on sheet POWER; Supplier 1: LCSC; Supplier Part Number 1: C380314; ComponentLink1Description: LCSC; ComponentLink1URL: https://www.lcsc.com/product-detail/Multilayer-Ceramic-Capacitors-MLCC-SMD-SMT_CCTC-TCC0603X5R106K100CT_C380314.html
D5 = LED_0805_RED: as D3 on sheet Driver; Supplier 1: LCSC; Supplier Part Number 1: C965812; ComponentLink1Description: LCSC; ComponentLink1URL: https://www.lcsc.com/product-detail/Light-Emitting-Diodes-LED_XINGLIGHT-XL-2012SURC_C965812.html
D6 = LED_0805_Green: LED GREEN CLEAR 0805 SMD; Manufacturer: XINGLIGHT; Manufacturer Part Number: XL-2012UGC; Supplier 1: LCSC; Supplier Part Number 1: C965815; ComponentLink1Description: LCSC; ComponentLink1URL: https://www.lcsc.com/product-detail/Light-Emitting-Diodes-LED_XINGLIGHT-XL-2012UGC_C965815.html
D7 = TVS_5V_1CH_BID_SOD_123FL: 21.7A 200W@10/1000us 9.2V 7V Bidirectional 5V SOD-123FL ESD and Surge Protection (TVS/ESD) ROHS; Manufacturer: TDSEMIC; Manufacturer Part Number: SMF5.0CA; Supplier 1: LCSC; Supplier Part Number 1: C46956338; ComponentLink1Description: LCSC; ComponentLink1URL: https://lcsc.com/product-detail/ESD-and-Surge-Protection-TVS-ESD_TDSEMIC-SMF5-0CA_C46956338.html
j5 = CON_USB_TYPEC_16P: 3A USB 3.1 1 Surface Mount 16P Female -40℃~+85℃ Type-C SMD USB Connectors ROHS; Manufacturer: SHOU HAN; Manufacturer Part Number: TYPE-C-3.1-16PIN; Supplier 1: LCSC; Supplier Part Number 1: C7507405; ComponentLink1Description: LCSC; ComponentLink1URL: https://lcsc.com/product-detail/USB-Connectors_SHOU-HAN-TYPE-C-3-1-16PIN_C7507405.html
MD1 = CMP-194065-000003-1: WIFI MODULE 32MBITS SPI FLASH; Manufacturer: ESPRESSIF; Manufacturer Part Number: ESP32-WROOM-32-N4; ComponentLink2URL: https://www.espressif.com/sites/default/files/documentation/esp32-wroom-32d_esp32-wroom-32u_datasheet_en.pdf; ComponentLink2Description: Datasheet; ComponentLink3Description: LCSC; ComponentLink3URL: https://www.lcsc.com/product-detail/C82899.html?s_z=n_ESP32%2520WROOM%2520N4; Supplier 1: LCSC; Supplier Part Number 1: C82899
Q5 Q6 = BJT_N_MMBT3904-7-F: 40V 310mW 200mA NPN SOT-23 Single Bipolar Transistors RoHS; Manufacturer: DIODES; Manufacturer Part Number: MMBT3904-7-F; Supplier 1: LCSC; Supplier Part Number 1: C94514; ComponentLink1Description: LCSC; ComponentLink1URL: https://www.lcsc.com/product-detail/C94514.html?s_z=n_MMBT3904-7-F
R15 R18 R19 R25-R28 R32 = Res_10k_0603_1/10W: as R5 on sheet POWER; ComponentLink1URL: https://www.lcsc.com/product-detail/Chip-Resistor-Surface-Mount_FOJAN-FRC0603J103TS_C2930027.html; Supplier 1: LCSC; Supplier Part Number 1: C2930027; ComponentLink1Description: LCSC
R16 R17 R21-R24 R29 R30 = Res_0R_0603_1/10W: as R1 on sheet Spindle; ComponentLink1URL: https://www.lcsc.com/product-detail/Chip-Resistor-Surface-Mount_FOJAN-FRC0603P000-TS_C2907080.html; Supplier 1: LCSC; Supplier Part Number 1: C2907080; ComponentLink1Description: LCSC
R20 R31 = Res_1k_0603_1/10W: as R4 on sheet Spindle; ComponentLink1URL: https://www.lcsc.com/product-detail/Chip-Resistor-Surface-Mount_FOJAN-FRC0603J102-TS_C2907113.html; Supplier 1: LCSC; Supplier Part Number 1: C2907113; ComponentLink1Description: LCSC
R33 = Res_100R_0603_1/10W: RES SMD 100R OHM 5% 1/10W 0603; Manufacturer: FOJAN; Manufacturer Part Number: FRC0603J101 TS; ComponentLink1URL: https://www.lcsc.com/product-detail/Chip-Resistor-Surface-Mount_FOJAN-FRC0603J101-TS_C2907089.html; Supplier 1: LCSC; Supplier Part Number 1: C2907089; ComponentLink1Description: LCSC
R34 = Res_30_0603_1/10W: 100mW 30Ω 75V ±100ppm/℃ Thick Film Resistor ±5% 0603 Chip Resistor - Surface Mount RoHS; Manufacturer: FOJAN; Manufacturer Part Number: FRC0603J300 TS; ComponentLink1URL: https://www.lcsc.com/product-detail/Chip-Resistor-Surface-Mount_FOJAN-FRC0603J102-TS_C2907113.html; Supplier 1: LCSC; Supplier Part Number 1: C2907150; ComponentLink1Description: LCSC
R35 R36 = Res 5K1: 100mW 5.1kΩ 75V ±100ppm/℃ Thick Film Resistor ±1% 0603 Chip Resistor - Surface Mount RoHS; Manufacturer: FOJAN; Manufacturer Part Number: FRC0603F5101TS; ComponentLink1URL: https://www.lcsc.com/product-detail/C2907044.html?s_z=n_5.1k%2520resistor; Supplier 1: LCSC; Supplier Part Number 1: C2907044; ComponentLink1Description: LCSC
R37 = Res_191R_0603_1/10W: as R11 on sheet Driver; ComponentLink1URL: https://lcsc.com/product-detail/Chip-Resistor-Surface-Mount_FOJAN-FRC0603F1910TS_C3000718.html; Supplier 1: LCSC; Supplier Part Number 1: C3000718; ComponentLink1Description: LCSC
R38 = Res_330R_0603_1/10W: as R2 on sheet Spindle; ComponentLink1URL: https://www.lcsc.com/product-detail/Chip-Resistor-Surface-Mount_FOJAN-FRC0603J331-TS_C2907152.html; Supplier 1: LCSC; Supplier Part Number 1: C2907152; ComponentLink1Description: LCSC
SW1 SW2 = Sw_PUSH_4.5x4.5x5.0xmm: SWITCH TACTILE SPST-NO 0.05A 12V; Manufacturer: BZCN; Manufacturer Part Number: TSC015A05026A; Supplier 1: LCSC; Supplier Part Number 1: C2888509; Last modified by: N-A.Potosi; Last modified date: 20190222; ComponentLink1Description: LCSC; ComponentLink1URL: https://www.lcsc.com/product-detail/Tactile-Switches_BZCN-TSC015A05026A_C2888509.html
U3 = IC_SGL_USB2UART-BRIDGE_20QFN: IC USB TO UART BRIDGE QFN20; Manufacturer: Silicon Labs; Manufacturer Part Number: CP2102N-A02-GQFN20R; Supplier 1: LCSC; Supplier Part Number 1: C969913; ComponentLink1Description: LCSC; ComponentLink1URL: https://www.lcsc.com/product-detail/USB-ICs_SILICON-LABS-CP2102N-A02-GQFN20R_C969913.html
U4 = TVS_5.25V_2CH_SOT_23_6: TVS DIODE 5.25V 17V SOT23-6; Manufacturer: STMicroelectronics; ComponentLink1Description: LCSC; ComponentLink1URL: https://www.lcsc.com/product-detail/ESD-Protection-Devices_STMicroelectronics-USBLC6-2SC6_C7519.html; Supplier 1: LCSC; Manufacturer Part Number: USBLC6-2SC6; Supplier Part Number 1: C7519

## Sheet Sensors.SchDoc
size A4; Organization: Altium Limited; Address1: L3, 12a Rodborough Rd; Address2: Frenchs Forest; Address3: NSW; Address4: Australia 2086; SheetNumber: 2; SheetTotal: 7
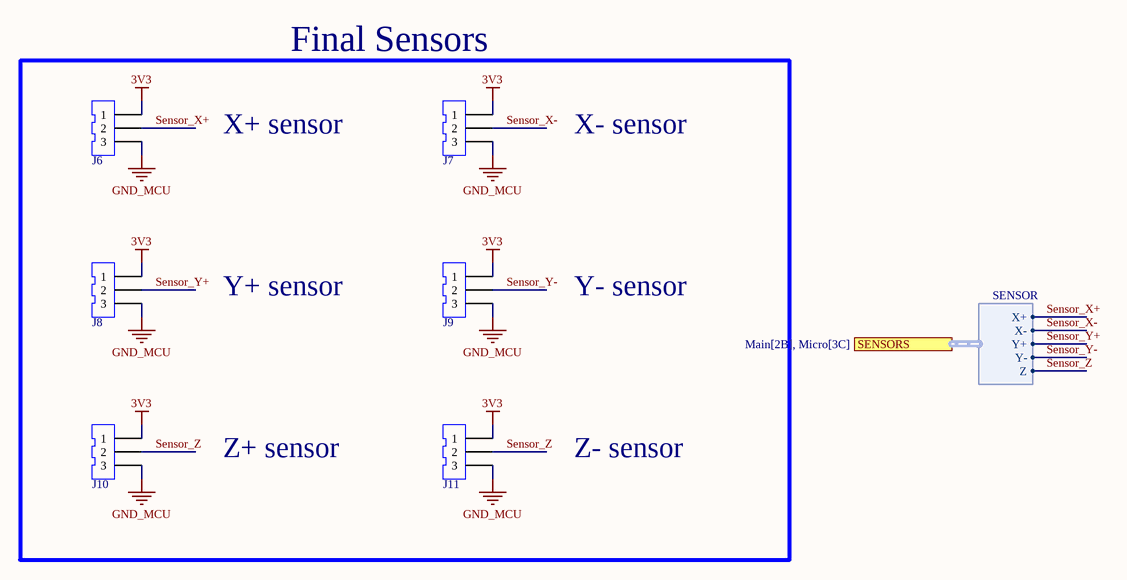
[diagram p6: Sensors.SchDoc]

### Parts
J6  CONN HEADER TH 3POS 2.5mm  [JST_B3B-XH-A]  (value not drawn)
J7  CONN HEADER TH 3POS 2.5mm  [JST_B3B-XH-A]  (value not drawn)
J8  CONN HEADER TH 3POS 2.5mm  [JST_B3B-XH-A]  (value not drawn)
J9  CONN HEADER TH 3POS 2.5mm  [JST_B3B-XH-A]  (value not drawn)
J10  CONN HEADER TH 3POS 2.5mm  [JST_B3B-XH-A]  (value not drawn)
J11  CONN HEADER TH 3POS 2.5mm  [JST_B3B-XH-A]  (value not drawn)

### Ports
SENSORS (harness SENSOR, see Main[2B], Micro[3C])

### Harnesses
SENSOR: X-, Y+, Y-, X+, Z

### Nets
3V3: J6.1 J7.1 J8.1 J9.1 J10.1 J11.1
GND_MCU: J6.3 J7.3 J8.3 J9.3 J10.3 J11.3  [project net GND]
Sensor_X+: J6.2 ; port SENSORS.X+
Sensor_X-: J7.2 ; port SENSORS.X-
Sensor_Y+: J8.2 ; port SENSORS.Y+
Sensor_Y-: J9.2 ; port SENSORS.Y-
Sensor_Z: J10.2 J11.2 ; port SENSORS.Z

### Notes on the sheet
- Final Sensors
- X+ sensor
- X- sensor
- Y+ sensor
- Y- sensor
- Z+ sensor
- Z- sensor
- Title
- Size:
- Date:
- A4
- Number:
- Time:
- Revision:
- Sheet
- of
- File:

### Library data of the parts
J6-J11 = Connector JST 3pin: 3P 1x3P XH Tin -25℃~+85℃ White 2.5mm 250V 3 3A 1 Through Hole Through Hole,P=2.5mm Headers, Male Pins RoHS; Manufacturer: JST; Manufacturer Part Number: B3B-XH-A(LF)(SN); Supplier 1: LCSC; Supplier Part Number 1: C144394; ComponentLink1Description: LCSC; ComponentLink1URL: https://www.lcsc.com/product-detail/C144394.html?s_z=n_JST%2520b3

## Nets that join several sheets
3V3: POWER (C6.1 U1.2), MicroSD_Card (C10.1 CARD1.4), Micro (15 pins), Sensors (6 pins)
+5: Spindle (D1.2 R1.2 Relay1.2), POWER (6 pins), Dx (6 pins), Dy (6 pins), Dz (6 pins)
GND: Spindle (C1.2 Q2.2 R3.2 R4.1), POWER (11 pins), Dx (6 pins), Dy (6 pins), Dz (6 pins), MicroSD_Card (C10.2 CARD1.6), Micro (37 pins), Sensors (6 pins)
VMOTOR: POWER (C7.1 J3.1 R5.1 U2.8), Dx (C9_Dx.1 Dr1_Dx.9), Dy (C9_Dy.1 Dr1_Dy.9), Dz (C9_Dz.1 Dr1_Dz.9)
CS_SD: MicroSD_Card (CARD1.2), Micro (MD1.29)
DIR: Dx (Dr1_Dx.8 Q3_Dx.1), Micro (MD1.33)
DIR: Dy (Dr1_Dy.8 Q3_Dy.1), Micro (MD1.28)
DIR: Dz (Dr1_Dz.8 Q3_Dz.1), Micro (MD1.11)
MISO: MicroSD_Card (CARD1.7), Micro (MD1.31)
MOSI: MicroSD_Card (CARD1.3), Micro (MD1.37)
NetMD1_10: Dz (R13_Dz.1), Micro (MD1.10)
NetMD1_16: Dy (R13_Dy.1), Micro (MD1.16)
NetMD1_26: Dx (R13_Dx.1), Micro (MD1.26)
SCK: MicroSD_Card (CARD1.5), Micro (MD1.30)
Sensor_X+: Micro (MD1.4 R19.2), Sensors (J6.2)
Sensor_X-: Micro (MD1.5 R26.2), Sensors (J7.2)
Sensor_Y+: Micro (MD1.6 R18.2), Sensors (J8.2)
Sensor_Y-: Micro (MD1.7 R25.2), Sensors (J9.2)
Sensor_Z: Micro (MD1.8), Sensors (J10.2 J11.2)
STEP: Dx (Dr1_Dx.7 Q4_Dx.1), Micro (MD1.36)
STEP: Dy (Dr1_Dy.7 Q4_Dy.1), Micro (MD1.27)
STEP: Dz (Dr1_Dz.7 Q4_Dz.1), Micro (MD1.12)
TRIGGER: Spindle (C1.1 Q1.1 R2.1), Micro (MD1.9)